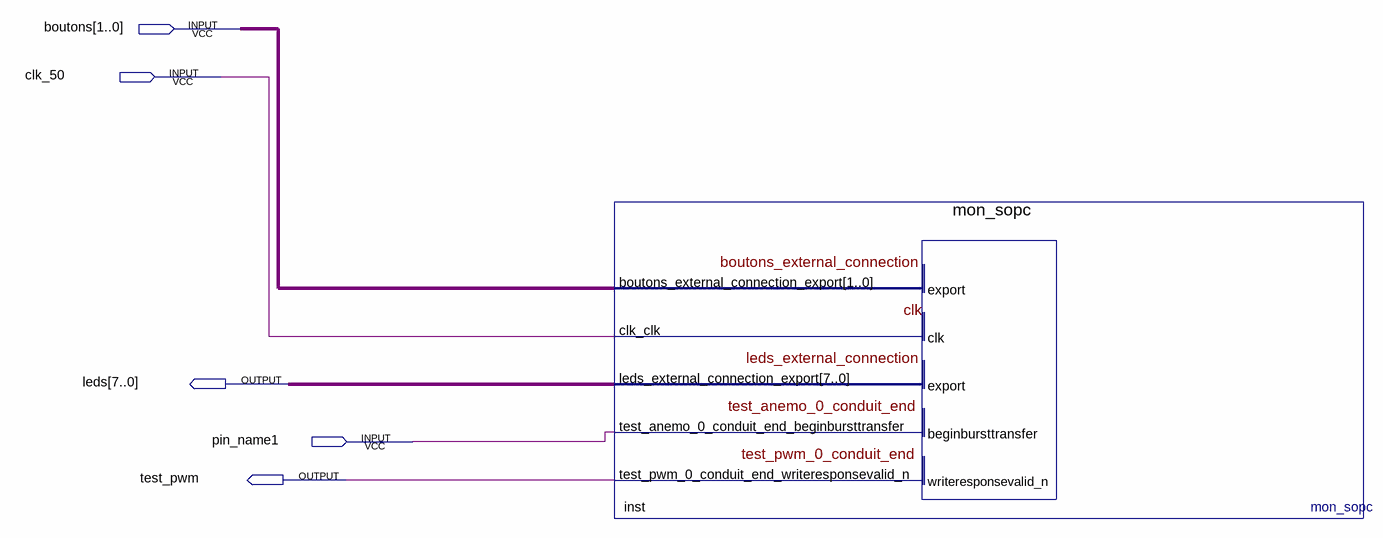
[diagram p0: schematic sheet]
// Quartus schematic sopc_compteur.bdf as structural Verilog: 1 symbols, 5 pins
module sopc_compteur (
  input  [1:0] boutons,
  input  clk_50,
  input  pin_name1,
  output [7:0] leds,
  output test_pwm
);

  mon_sopc inst (
    .boutons_external_connection_export(boutons), .clk_clk(clk_50),
    .test_anemo_0_conduit_end_beginbursttransfer(pin_name1), .leds_external_connection_export(leds),
    .test_pwm_0_conduit_end_writeresponsevalid_n(test_pwm));
endmodule
